# Altium project RADMBo.PrjPcb
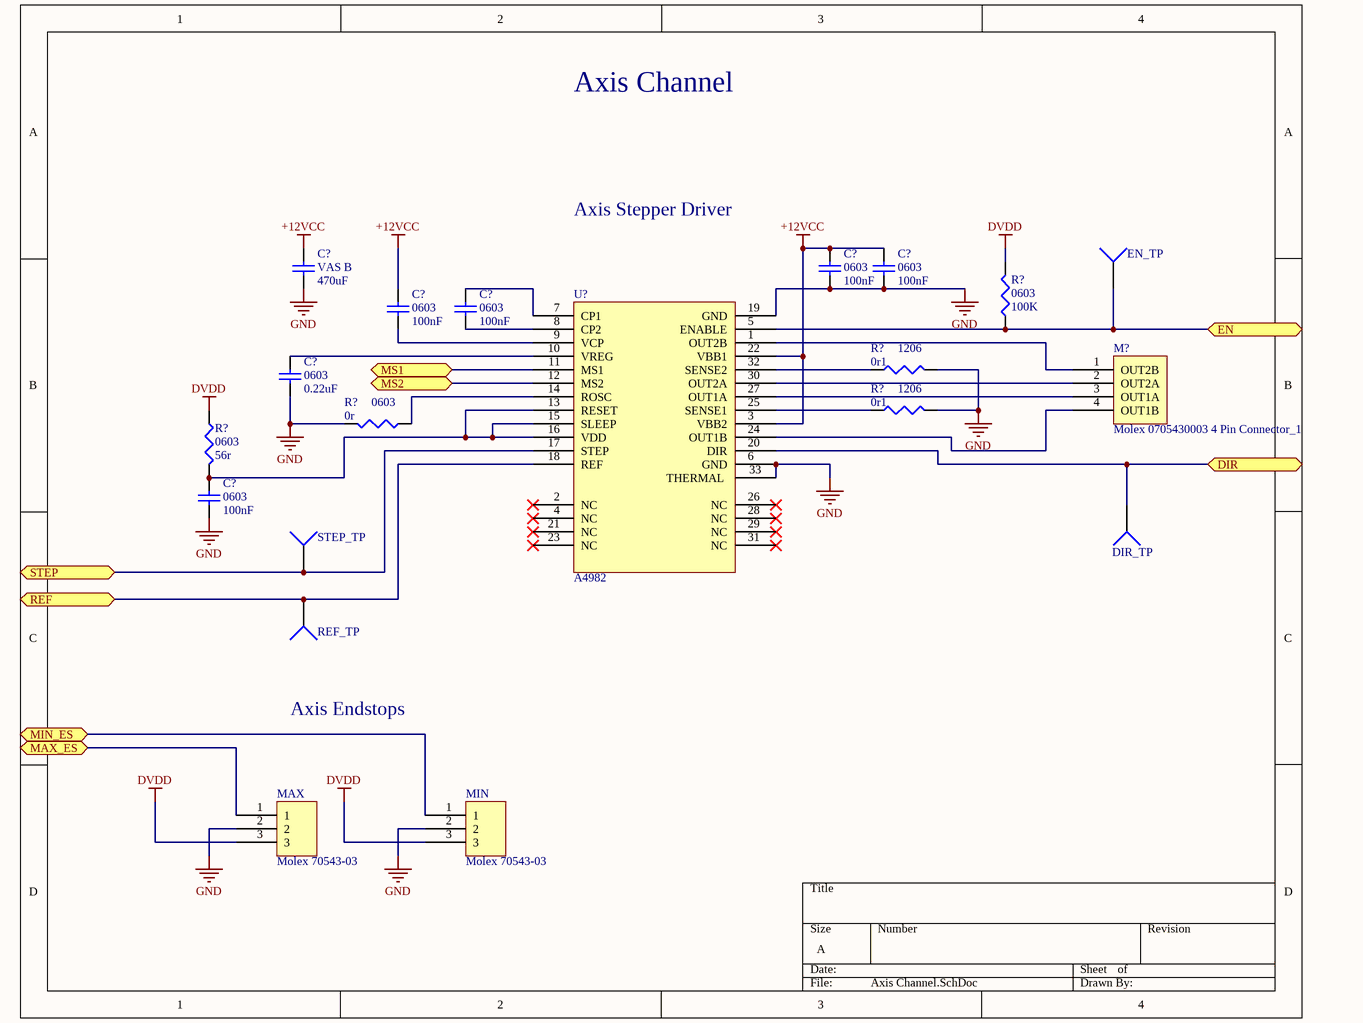
[diagram p0: Axis Channel.SchDoc]
5 sheets, 76 parts. Net scope: flat (ports and power ports of the same name join across sheets).
Sheets:
  Axis Channel.SchDoc
  Kinen Expansion Channel.SchDoc
  FET Channel.SchDoc
  Thermistor Channel.SchDoc
  Power.SchDoc

## Sheet Axis Channel.SchDoc
size A

### Parts
(Parts that share a designator on the sheet are numbered #1, #2 ... from top to bottom, then left to right.)
C?#1  VAS B  value 470uF  [Panasonic VS B]
C?#2  0603  value 100nF  [1608[0603]]
C?#3  0603  value 100nF  [1608[0603]]
C?#4  0603  value 100nF  [1608[0603]]
C?#5  0603  value 100nF  [1608[0603]]
C?#6  0603  value 0.22uF  [1608[0603]]
C?#7  0603  value 100nF  [1608[0603]]
DIR_TP  TP4  [PIN1]  (value not drawn)
EN_TP  TP4  [PIN1]  (value not drawn)
M?  Molex 0705430003 4 Pin Connector_1  [Molex 0705430003]
MAX  Molex 70543-03  [MOLEX Endstop]
MIN  Molex 70543-03  [MOLEX Endstop]
R?#1  0603  value 100K  [J1-0603]
R?#2  1206  value 0r1  [1206 SMD Resistor]
R?#3  1206  value 0r1  [1206 SMD Resistor]
R?#4  0603  value 56r  [J1-0603]
R?#5  0603  value 0r  [J1-0603]
REF_TP  TP4  [PIN1]  (value not drawn)
STEP_TP  TP4  [PIN1]  (value not drawn)
U?  A4982  [QFN50P508X508X100_HS-33N]

### Ports
DIR, EN, MAX_ES, MIN_ES, MS1, MS2, REF, STEP

### Nets
+12VCC: C?#1.2 C?#2.2 C?#3.2 C?#4.2 U?.3(VBB2) U?.22(VBB1)
DVDD: MAX.3 MIN.3 R?#1.2 R?#4.1
GND: C?#1.1 C?#2.1 C?#3.1 C?#6.1 C?#7.1 MAX.2 MIN.2 R?#2.2 R?#3.2 R?#5.2 U?.6(GND) U?.19(GND) U?.33(THERMAL)
NetC?#4_1: C?#4.1 U?.9(VCP)
NetC?#5_1: C?#5.1 U?.8(CP2)
NetC?#5_2: C?#5.2 U?.7(CP1)
NetC?#6_2: C?#6.2 U?.10(VREG)
NetC?#7_2: C?#7.2 R?#4.2 U?.13(RESET) U?.15(SLEEP) U?.16(VDD)
NetDIR_TP_1: DIR_TP.1 U?.20(DIR) ; port DIR
NetEN_TP_1: EN_TP.1 R?#1.1 U?.5(ENABLE) ; port EN
NetM?_1: M?.1(OUT2B) U?.1(OUT2B)
NetM?_2: M?.2(OUT2A) U?.30(OUT2A)
NetM?_3: M?.3(OUT1A) U?.27(OUT1A)
NetM?_4: M?.4(OUT1B) U?.24(OUT1B)
NetMAX_1: MAX.1 ; port MAX_ES
NetMIN_1: MIN.1 ; port MIN_ES
NetR?#2_1: R?#2.1 U?.32(SENSE2)
NetR?#3_1: R?#3.1 U?.25(SENSE1)
NetR?#5_1: R?#5.1 U?.14(ROSC)
NetREF_TP_1: REF_TP.1 U?.18(REF) ; port REF
NetSTEP_TP_1: STEP_TP.1 U?.17(STEP) ; port STEP
NetU?_11: U?.11(MS1) ; port MS1
NetU?_12: U?.12(MS2) ; port MS2

Not connected (* = marked no-connect by the designer): U? 2(NC)* 4(NC)* 21(NC)* 23(NC)* 26(NC)* 28(NC)* 29(NC)* 31(NC)*

### Notes on the sheet
- Axis Channel
- Axis Stepper Driver
- Axis Endstops

### Library data of the parts
C?#1-C?#7 = Cap Semi: Capacitor (Semiconductor SIM Model); Published: 8-Jun-2000; LatestRevisionDate: 29-May-2009; LatestRevisionNote: IPC-7351 Footprint Added.; PackageReference: C1206; Publisher: Altium Limited; PackageDescription: Chip Capacitor
DIR_TP EN_TP REF_TP STEP_TP = Socket: LatestRevisionDate: 17-Jul-2002; LatestRevisionNote: Re-released for DXP Platform.; Publisher: Altium Limited
MAX MIN = Molex Endstop
R?#1-R?#5 = Res3: Resistor; Published: 8-Jun-2000; LatestRevisionDate: 29-May-2009; LatestRevisionNote: IPC-7351 Footprint Added.; PackageReference: J1-0603; Publisher: Altium Limited; PackageDescription: Chip Resistor
U? = A4982: Alllegor A4982 Stepper Driver

## Sheet Kinen Expansion Channel.SchDoc
size A
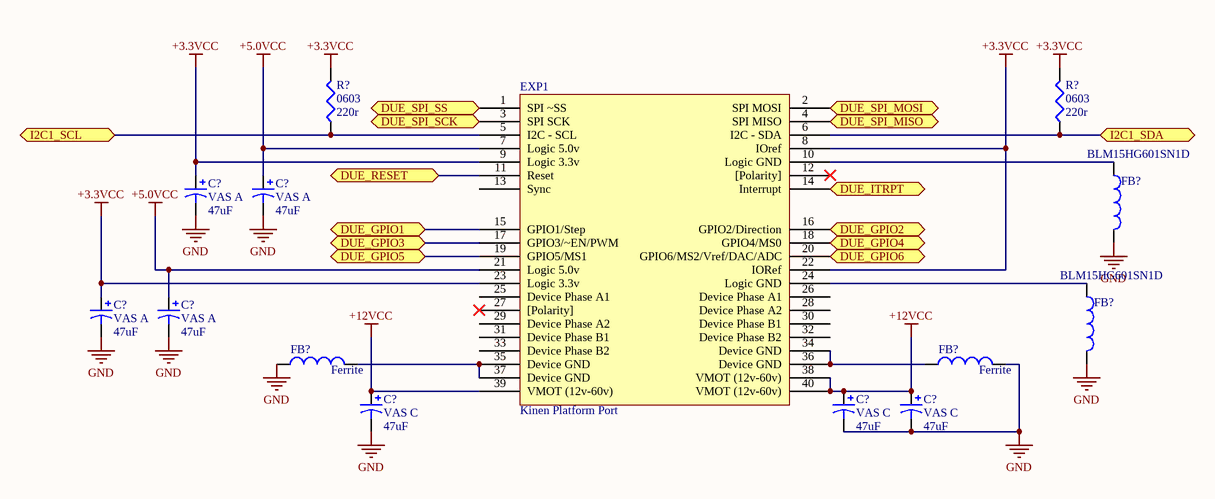
[diagram p1: Kinen Expansion Channel.SchDoc]

### Parts
(Parts that share a designator on the sheet are numbered #1, #2 ... from top to bottom, then left to right.)
C?#8  VAS A  value 47uF  [Panasonic VS A]
C?#9  VAS A  value 47uF  [Panasonic VS A]
C?#10  VAS A  value 47uF  [Panasonic VS A]
C?#11  VAS A  value 47uF  [Panasonic VS A]
C?#12  VAS C  value 47uF  [Panasonic VS C]
C?#13  VAS C  value 47uF  [Panasonic VS C]
C?#14  VAS C  value 47uF  [Panasonic VS C]
EXP1  Kinen Platform Port  [Kinen Port]
FB?#1  BLM15HG601SN1D  [BLM18PG121SN1D]
FB?#2  BLM15HG601SN1D  [BLM18PG121SN1D]
FB?#3  Ferrite  [SM 0805 - gap trimmed]
FB?#4  Ferrite  [SM 0805 - gap trimmed]
R?#6  0603  value 220r  [J1-0603]
R?#7  0603  value 220r  [J1-0603]

### Ports
DUE_GPIO1, DUE_GPIO2, DUE_GPIO3, DUE_GPIO4, DUE_GPIO5, DUE_GPIO6, DUE_ITRPT, DUE_RESET, DUE_SPI_MISO, DUE_SPI_MOSI, DUE_SPI_SCK, DUE_SPI_SS, I2C1_SCL, I2C1_SDA

### Nets
+3.3VCC: C?#8.1 C?#10.1 EXP1.8(IOref) EXP1.9(Logic_3.3v) EXP1.22(IORef) EXP1.23(Logic_3.3v) R?#6.2 R?#7.2
+5.0VCC: C?#9.1 C?#11.1 EXP1.7(Logic_5.0v) EXP1.21(Logic_5.0v)
+12VCC: C?#12.1 C?#13.1 C?#14.1 EXP1.38(VMOT_(12v-60v)) EXP1.39(VMOT_(12v-60v)) EXP1.40(VMOT_(12v-60v))
GND: C?#8.2 C?#9.2 C?#10.2 C?#11.2 C?#12.2 C?#13.2 C?#14.2 FB?#1.2 FB?#2.2 FB?#3.1 FB?#4.2
NetEXP1_1: EXP1.1(SPI_~SS) ; port DUE_SPI_SS
NetEXP1_2: EXP1.2(SPI_MOSI) ; port DUE_SPI_MOSI
NetEXP1_3: EXP1.3(SPI_SCK) ; port DUE_SPI_SCK
NetEXP1_4: EXP1.4(SPI_MISO) ; port DUE_SPI_MISO
NetEXP1_5: EXP1.5(I2C_-_SCL) R?#6.1 ; port I2C1_SCL
NetEXP1_6: EXP1.6(I2C_-_SDA) R?#7.1 ; port I2C1_SDA
NetEXP1_10: EXP1.10(Logic_GND) FB?#1.1
NetEXP1_11: EXP1.11(Reset) ; port DUE_RESET
NetEXP1_14: EXP1.14(Interrupt) ; port DUE_ITRPT
NetEXP1_15: EXP1.15(GPIO1/Step) ; port DUE_GPIO1
NetEXP1_16: EXP1.16(GPIO2/Direction) ; port DUE_GPIO2
NetEXP1_17: EXP1.17(GPIO3/~EN/PWM) ; port DUE_GPIO3
NetEXP1_18: EXP1.18(GPIO4/MS0) ; port DUE_GPIO4
NetEXP1_19: EXP1.19(GPIO5/MS1) ; port DUE_GPIO5
NetEXP1_20: EXP1.20(GPIO6/MS2/Vref/DAC/ADC) ; port DUE_GPIO6
NetEXP1_24: EXP1.24(Logic_GND) FB?#2.1
NetEXP1_34: EXP1.34(Device_GND) EXP1.36(Device_GND) FB?#4.1
NetEXP1_35: EXP1.35(Device_GND) EXP1.37(Device_GND) FB?#3.2

Not connected (* = marked no-connect by the designer): EXP1 12([Polarity])* 13(Sync) 25(Device_Phase_A1) 26(Device_Phase_A1) 27([Polarity])* 28(Device_Phase_A2) 29(Device_Phase_A2) 30(Device_Phase_B1) 31(Device_Phase_B1) 32(Device_Phase_B2) 33(Device_Phase_B2)

### Library data of the parts
C?#8-C?#14 = Cap Pol3: Polarized Capacitor (Surface Mount); Published: 8-Jun-2000; LatestRevisionDate: 29-May-2009; LatestRevisionNote: IPC-7351 Footprint Added.; PackageReference: C0805; Publisher: Altium Limited; PackageDescription: Chip Capacitor
EXP1 = Kinen Port
FB?#1-FB?#4 = Inductor: Code_IEC: 1005; Published: 8-Jun-2000; LatestRevisionDate: 17-Jul-2002; LatestRevisionNote: Re-released for DXP Platform.; PackageReference: 0402-A; Publisher: Altium Limited; Code_JEITA: 0402
R?#6 R?#7 = Res3: Resistor; Published: 8-Jun-2000; LatestRevisionDate: 29-May-2009; LatestRevisionNote: IPC-7351 Footprint Added.; PackageReference: J1-0603; Publisher: Altium Limited; PackageDescription: Chip Resistor

## Sheet FET Channel.SchDoc
size A
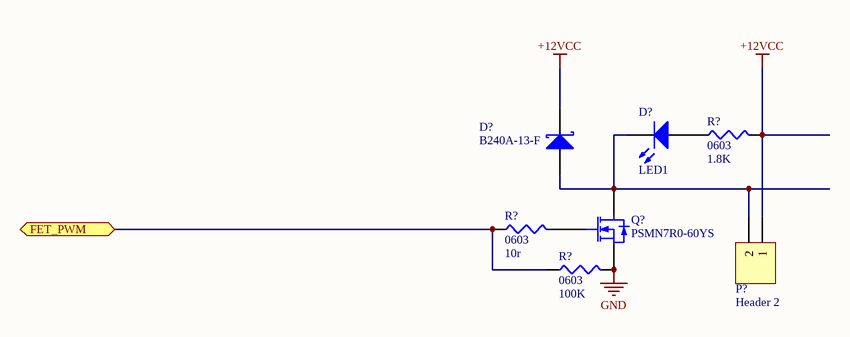
[diagram p2: FET Channel.SchDoc]

### Parts
(Parts that share a designator on the sheet are numbered #1, #2 ... from top to bottom, then left to right.)
D?#1  B240A-13-F  [SMB]
D?#2  LED1  [SM 0805 polarized]
P?  Header 2  [HDR1X2]
Q?  PSMN7R0-60YS  [PSMN7R0-60YS]
R?#8  0603  value 1.8K  [J1-0603]
R?#9  0603  value 10r  [J1-0603]
R?#10  0603  value 100K  [J1-0603]

### Ports
FET_PWM

### Nets
3: Q?.1(S) Q?.2(S)
+12VCC: D?#1.2(K) P?.1 R?#8.2
GND: Q?.3(S) R?#10.2
NetD?#1_1: D?#1.1(A) D?#2.2(K) P?.2 Q?.5(D)
NetD?#2_1: D?#2.1(A) R?#8.1
NetQ?_4: Q?.4(G) R?#9.2
NetR?#9_1: R?#9.1 R?#10.1 ; port FET_PWM

### Library data of the parts
D?#1 = D Schottky: Schottky Diode; Published: 8-Jun-2000; LatestRevisionDate: 17-Jul-2002; LatestRevisionNote: Re-released for DXP Platform.; PackageReference: SMB; Publisher: Altium Limited; PackageDescription: DO-214-AA/SMB; 2 C-Bend Leads; Body 5.3 x 3.6 mm, inc. leads (LxW); Code_JEDEC: DO-214-AA
D?#2 = LED1: Typical RED GaAs LED; Published: 8-Jun-2000; LatestRevisionDate: 08-Jul-2005; LatestRevisionNote: Mech Layer 1 removed.; PackageReference: LED-1; Publisher: Altium Limited; PackageDescription: LED; 2 Leads
P? = Header 2: Header, 2-Pin; LatestRevisionDate: 17-Jul-2002; LatestRevisionNote: Re-released for DXP Platform.; Publisher: Altium Limited
Q? = PSMN7R0-60YS: N-Channel MOSFET; Published: 8-Jun-2000; LatestRevisionDate: 17-Jul-2002; LatestRevisionNote: Re-released for DXP Platform.; PackageVersion: 1995/1996; PackageReference: E3; Publisher: Altium Limited; PackageDescription: TO, Flat Index; 3 In-Line, Axial Leads; Body Dia. 4.6mm; Lead Dia. 0.5 mm (max)
R?#8-R?#10 = Res3: Resistor; Published: 8-Jun-2000; LatestRevisionDate: 29-May-2009; LatestRevisionNote: IPC-7351 Footprint Added.; PackageReference: J1-0603; Publisher: Altium Limited; PackageDescription: Chip Resistor

## Sheet Thermistor Channel.SchDoc
size A

## Sheet Power.SchDoc
size A
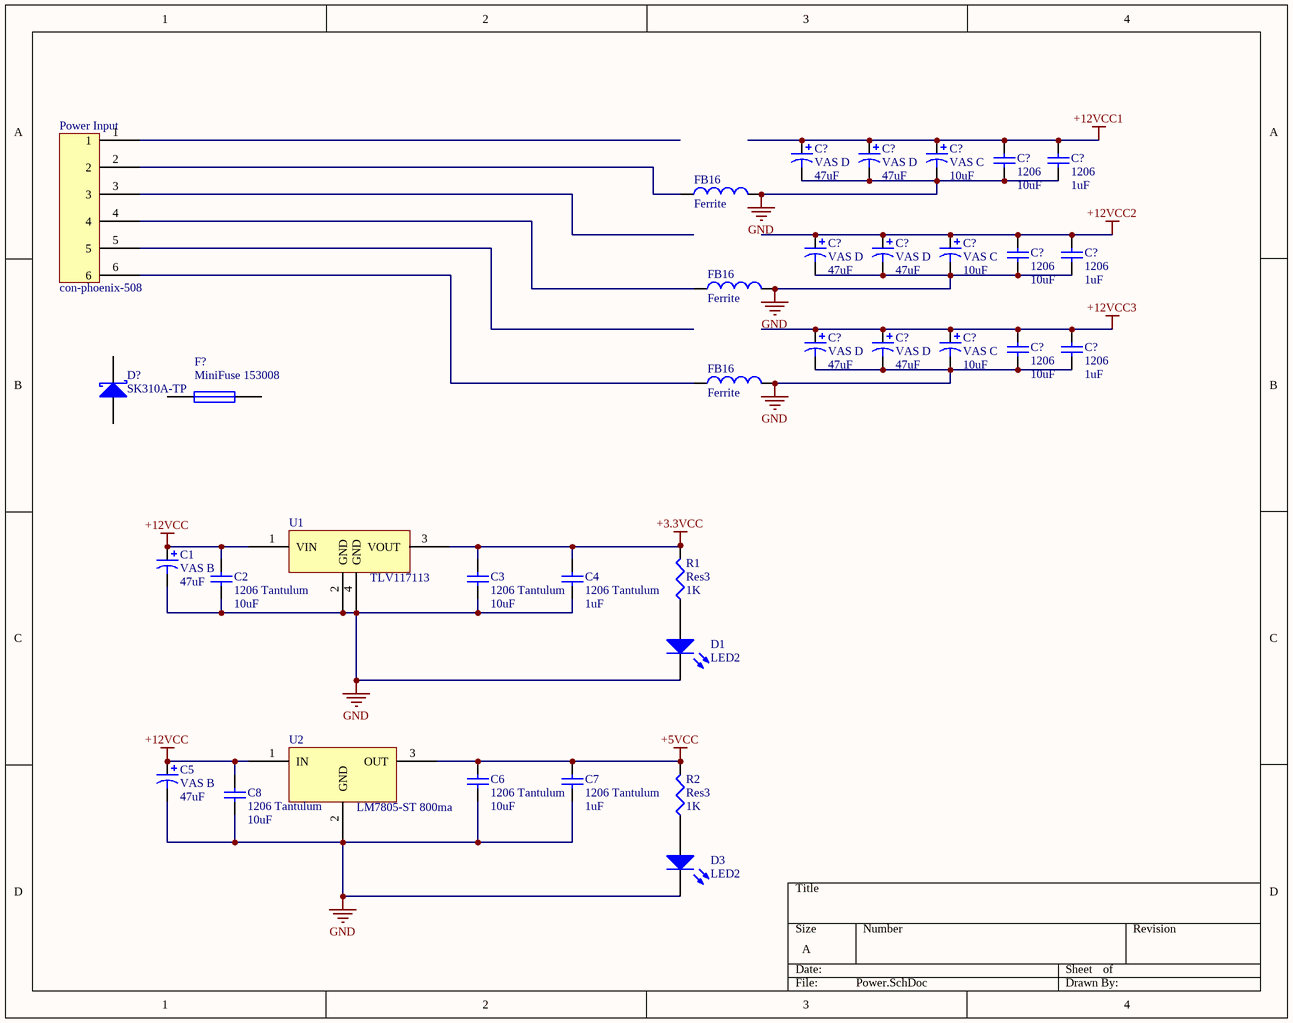
[diagram p3: Power.SchDoc]

### Parts
(Parts that share a designator on the sheet are numbered #1, #2 ... from top to bottom, then left to right.)
C1  VAS B  value 47uF  [Panasonic VS B]
C2  1206 Tantulum  value 10uF  [C1206]
C3  1206 Tantulum  value 10uF  [C1206]
C4  1206 Tantulum  value 1uF  [C1206]
C5  VAS B  value 47uF  [Panasonic VS B]
C6  1206 Tantulum  value 10uF  [C1206]
C7  1206 Tantulum  value 1uF  [C1206]
C8  1206 Tantulum  value 10uF  [C1206]
C?#15  VAS D  value 47uF  [Panasonic VS D]
C?#16  VAS D  value 47uF  [Panasonic VS D]
C?#17  VAS C  value 10uF  [Panasonic VS C]
C?#18  1206  value 10uF  [C1206]
C?#19  1206  value 1uF  [C1206]
C?#20  VAS D  value 47uF  [Panasonic VS D]
C?#21  VAS D  value 47uF  [Panasonic VS D]
C?#22  VAS C  value 10uF  [Panasonic VS C]
C?#23  1206  value 10uF  [C1206]
C?#24  1206  value 1uF  [C1206]
C?#25  VAS D  value 47uF  [Panasonic VS D]
C?#26  VAS D  value 47uF  [Panasonic VS D]
C?#27  VAS C  value 10uF  [Panasonic VS C]
C?#28  1206  value 10uF  [C1206]
C?#29  1206  value 1uF  [C1206]
D1  LED2  [SM 0805 polarized]
D3  LED2  [SM 0805 polarized]
D?#3  SK310A-TP  [SK310A-TP]
F?  MiniFuse 153008  [TinyFuseATO_Carrier]
FB16#1  Ferrite  [SM 0805 - gap trimmed]
FB16#2  Ferrite  [SM 0805 - gap trimmed]
FB16#3  Ferrite  [SM 0805 - gap trimmed]
Power_Input  con-phoenix-508  [con-phoenix-508]
R1  Res3  value 1K  [SM 0805 - gap trimmed]
R2  Res3  value 1K  [SM 0805 - gap trimmed]
U1  TLV117113  [TLV117112]
U2  LM7805-ST 800ma  [DPAK-3]

### Nets
+3.3VCC: C3.2 C4.2 R1.2 U1.3(VOUT)
+5VCC: C6.2 C7.2 R2.2 U2.3(OUT)
+12VCC: C1.1 C2.2 C5.1 C8.2 U1.1(VIN) U2.1(IN)
+12VCC1: C?#15.1 C?#16.1 C?#17.1 C?#18.2 C?#19.2
+12VCC2: C?#20.1 C?#21.1 C?#22.1 C?#23.2 C?#24.2
+12VCC3: C?#25.1 C?#26.1 C?#27.1 C?#28.2 C?#29.2
GND: C1.2 C2.1 C3.1 C4.1 C5.2 C6.1 C7.1 C8.1 C?#15.2 C?#16.2 C?#17.2 C?#18.1 C?#19.1 C?#20.2 C?#21.2 C?#22.2 C?#23.1 C?#24.1 C?#25.2 C?#26.2 C?#27.2 C?#28.1 C?#29.1 D1.1(A) D3.1(A) FB16#1.2 FB16#2.2 FB16#3.2 U1.2(GND) U1.4(GND) U2.2(GND)
NetD1_2: D1.2(K) R1.1
NetD3_2: D3.2(K) R2.1
NetFB16#1_1: FB16#1.1 Power_Input.2
NetFB16#2_1: FB16#2.1 Power_Input.4
NetFB16#3_1: FB16#3.1 Power_Input.6

Not connected (* = marked no-connect by the designer): D?#3 1(A) 2(K); F? 1 2; Power_Input 1 3 5

### Library data of the parts
C1 C5 C?#15-C?#17 C?#20-C?#22 C?#25-C?#27 = Cap Pol1: Polarized Capacitor (Radial); Published: 8-Jun-2000; LatestRevisionDate: 17-Jul-2002; LatestRevisionNote: Re-released for DXP Platform.; PackageReference: RB7.6-15; Publisher: Altium Limited; PackageDescription: Polarized Capacitor (Radial); 2 Leads
C2-C4 C6-C8 C?#18 C?#19 C?#23 C?#24 C?#28 C?#29 = Cap Semi: Capacitor (Semiconductor SIM Model); Published: 8-Jun-2000; LatestRevisionDate: 29-May-2009; LatestRevisionNote: IPC-7351 Footprint Added.; PackageReference: C1206; Publisher: Altium Limited; PackageDescription: Chip Capacitor
D1 D3 = LED2: Typical RED, GREEN, YELLOW, AMBER GaAs LED; Published: 8-Jun-2000; LatestRevisionDate: 17-Jul-2002; LatestRevisionNote: Re-released for DXP Platform.; PackageVersion: Feb-2002; PackageReference: 3.2X1.6X1.1; Publisher: Altium Limited; PackageDescription: SM LED; 2 Flat Leads
D?#3 = D Schottky: Schottky Diode; Published: 8-Jun-2000; LatestRevisionDate: 17-Jul-2002; LatestRevisionNote: Re-released for DXP Platform.; PackageReference: SMB; Publisher: Altium Limited; PackageDescription: DO-214-AA/SMB; 2 C-Bend Leads; Body 5.3 x 3.6 mm, inc. leads (LxW); Code_JEDEC: DO-214-AA
F? = Fuse 1: Fuse; Published: 8-Jun-2000; LatestRevisionDate: 17-Jul-2002; LatestRevisionNote: Re-released for DXP Platform.; PackageReference: PIN-W2/E2.8; Publisher: Altium Limited; PackageDescription: Thru-Hole; 2 Leads
FB16#1-FB16#3 = Inductor: Code_IEC: 1005; Published: 8-Jun-2000; LatestRevisionDate: 17-Jul-2002; LatestRevisionNote: Re-released for DXP Platform.; PackageReference: 0402-A; Publisher: Altium Limited; Code_JEITA: 0402
R1 R2 = Res3: Resistor; Published: 8-Jun-2000; LatestRevisionDate: 29-May-2009; LatestRevisionNote: IPC-7351 Footprint Added.; PackageReference: J1-0603; Publisher: Altium Limited; PackageDescription: Chip Resistor
U1 = TLV117112: Linear Regulator
U2 = LM708-ST 800ma

## Nets that join several sheets
+3.3VCC: Kinen Expansion Channel (8 pins), Power (C3.2 C4.2 R1.2 U1.3)
+12VCC: Axis Channel (6 pins), Kinen Expansion Channel (6 pins), FET Channel (D?#1.2 P?.1 R?#8.2), Power (6 pins)
GND: Axis Channel (13 pins), Kinen Expansion Channel (11 pins), FET Channel (Q?.3 R?#10.2), Power (31 pins)